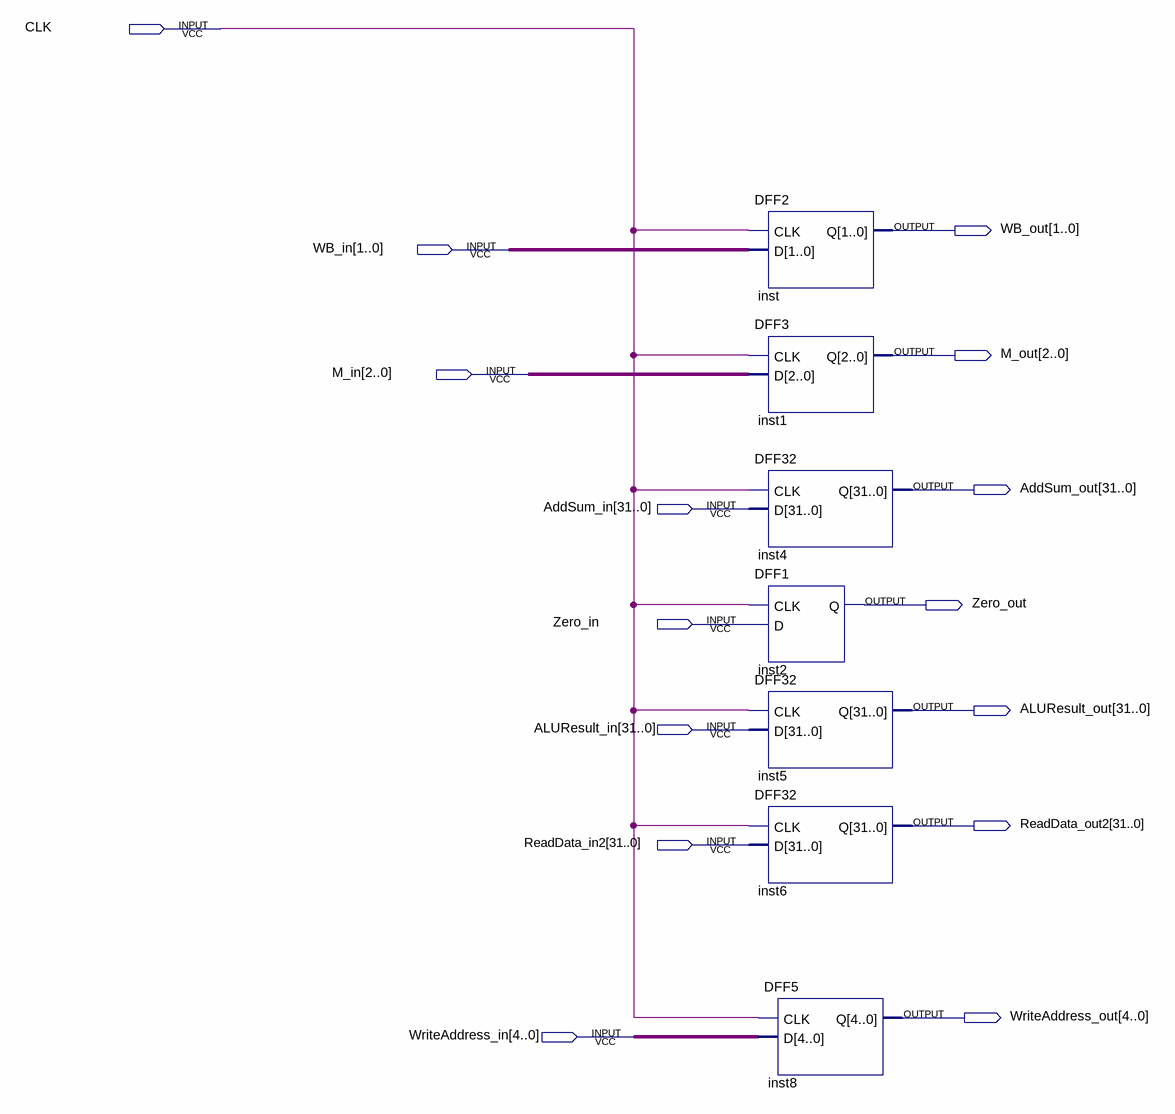
[diagram p0: schematic sheet]
// Quartus schematic EXE_WB.bdf as structural Verilog: 7 symbols, 15 pins
module EXE_WB (
  input  CLK,
  input  [1:0] WB_in,
  input  [2:0] M_in,
  input  [31:0] AddSum_in,
  input  Zero_in,
  input  [31:0] ALUResult_in,
  input  [31:0] ReadData_in2,
  input  [4:0] WriteAddress_in,
  output [1:0] WB_out,
  output [2:0] M_out,
  output [31:0] AddSum_out,
  output Zero_out,
  output [31:0] ALUResult_out,
  output [31:0] ReadData_out2,
  output [4:0] WriteAddress_out
);

  DFF2 inst (.CLK(CLK), .D(WB_in), .Q(WB_out));
  DFF3 inst1 (.CLK(CLK), .D(M_in), .Q(M_out));
  DFF32 inst4 (.CLK(CLK), .D(AddSum_in), .Q(AddSum_out));
  DFF1 inst2 (.CLK(CLK), .D(Zero_in), .Q(Zero_out));
  DFF32 inst5 (.CLK(CLK), .D(ALUResult_in), .Q(ALUResult_out));
  DFF32 inst6 (.CLK(CLK), .D(ReadData_in2), .Q(ReadData_out2));
  DFF5 inst8 (.CLK(CLK), .D(WriteAddress_in), .Q(WriteAddress_out));
endmodule
